# EAGLE design battery (EAGLE 6.4)
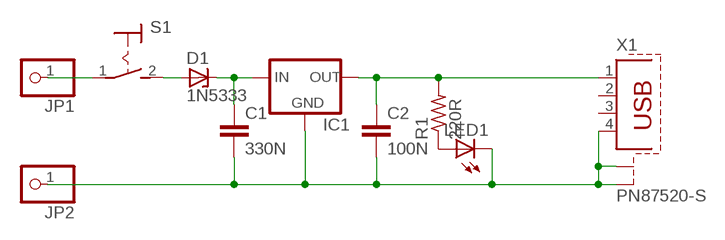
[diagram p0: schematic, sheet 1]

## Parts
C1  330N  C-EU025-025X050  [C025-025X050]
C2  100N  C-EU025-025X050  [C025-025X050]
D1  1N5333  [C1702-15]
IC1  78MXXS  [78MXXS]
JP1  PINHD-1X1  [1X01]
JP2  PINHD-1X1  [1X01]
LED1  LED3MM  [LED3MM]
R1  220R  R-US_0414/15  [0414/15]
S1  MS243  [MS243]
X1  PN87520-S  [PN87520-S]

## Nets
N$1: LED1.A R1.1
N$2: C1.2 C2.2 IC1.GND JP2.1 LED1.K(C) X1.4 X1.S1 X1.S2
N$3: JP1.1 S1.1(P)
N$4: C1.1 D1.C IC1.IN
N$5: C2.1 IC1.OUT R1.2 X1.1
N$6: D1.A S1.2(S)
Unconnected: X1.2 X1.3

## Library data of the parts
C1 C2 = rcl:C-EU: CAPACITOR, European symbol
D1 = diode:1N5333: Z DIODE 3.3 V, 5W, 5 percent (Motorola)
IC1 = v-reg:78MXXS: VOLTAGE REGULATOR
JP1 JP2 = pinhead:PINHD-1X1: PIN HEADER
LED1 = led:LED: LED OSRAM: - CHIPLED LG R971, LG N971, LY N971, LG Q971, LY Q971, LO R971, LY R971 LH N974, LH R974 LS Q976, LO Q976, LY Q976 LO Q996 - Hyper CHIPLED LW Q18S LB Q993, LB Q99A, LB R99A - SideLED LS A670, LO A670, LY A670, LG A670, LP A670 LB A673, LV A673, LT A673, LW A673 LH A674 LY A675 LS A676, LA A676, LO A676, LY A676, LW A676 LS A679, LY A679, LG A679 - Hyper Micro SIDELED® LS Y876, LA Y876, LO Y876, LY Y876 LT Y87S - SmartLED LW L88C, LW L88S LB L89C, LB L89S, LG L890 LS L89K, LO L89K, LY L89K LS L896, LA L896, LO L896, LY L896 - TOPLED LS T670, LO T670, LY T670, LG T670, LP T670 LSG T670, LSP T670, LSY T670, LOP T670, LYG T670 LG T671, LOG T671, LSG T671 LB T673, LV T673, LT T673, LW T673 LH T674 LS T676, LA T676, LO T676, LY T676, LB T676, LH T676, LSB T676, LW T676 LB T67C, LV T67C, LT T67C, LS T67K, LO T67K, LY T67K, LW E67C LS E67B, LA E67B, LO E67B, LY E67B, LB E67C, LV E67C, LT E67C LW T67C LS T679, LY T679, LG T679 LS T770, LO T770, LY T770, LG T770, LP T770 LB T773, LV T773, LT T773, LW T773 LH T774 LS E675, LA E675, LY E675, LS T675 LS T776, LA T776, LO T776, LY T776, LB T776 LHGB T686 LT T68C, LB T68C - Hyper Mini TOPLED® LB M676 - Mini TOPLED Santana® LG M470 LS M47K, LO M47K, LY M47K Source: http://www.osram.convergy.de LUXEON: - LUMILED® LXK2-PW12-R00, LXK2-PW12-S00, LXK2-PW14-U00, LXK2-PW14-V00 LXK2-PM12-R00, LXK2-PM12-S00, LXK2-PM14-U00 LXK2-PE12-Q00, LXK2-PE12-R00, LXK2-PE12-S00, LXK2-PE14-T00, LXK2-PE14-U00 LXK2-PB12-K00, LXK2-PB12-L00, LXK2-PB12-M00, LXK2-PB14-N00, LXK2-PB14-P00, LXK2-PB14-Q00 LXK2-PR12-L00, LXK2-PR12-M00, LXK2-PR14-Q00, LXK2-PR14-R00 LXK2-PD12-Q00, LXK2-PD12-R00, LXK2-PD12-S00 LXK2-PH12-R00, LXK2-PH12-S00 LXK2-PL12-P00, LXK2-PL12-Q00, LXK2-PL12-R00 Source: www.luxeon.com KINGBRIGHT: KA-3528ASYC Source: www.kingbright.com
R1 = rcl:R-US_: RESISTOR, American symbol
S1 = switch:MS243: TOGGLE SWITCH
X1 = con-berg:PN87520-S; OC_FARNELL: unknown; OC_NEWARK: unknown

## Board
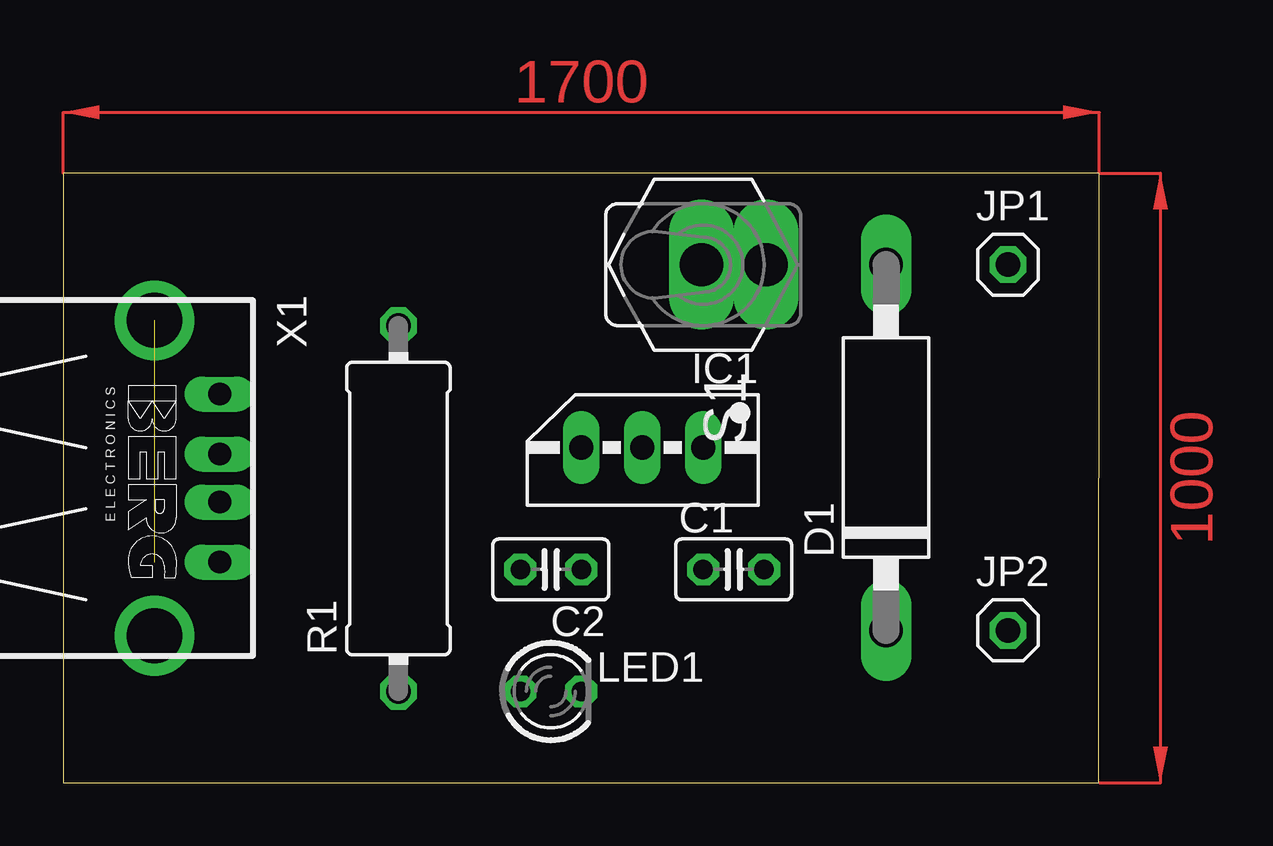
[diagram p1: board, top side]
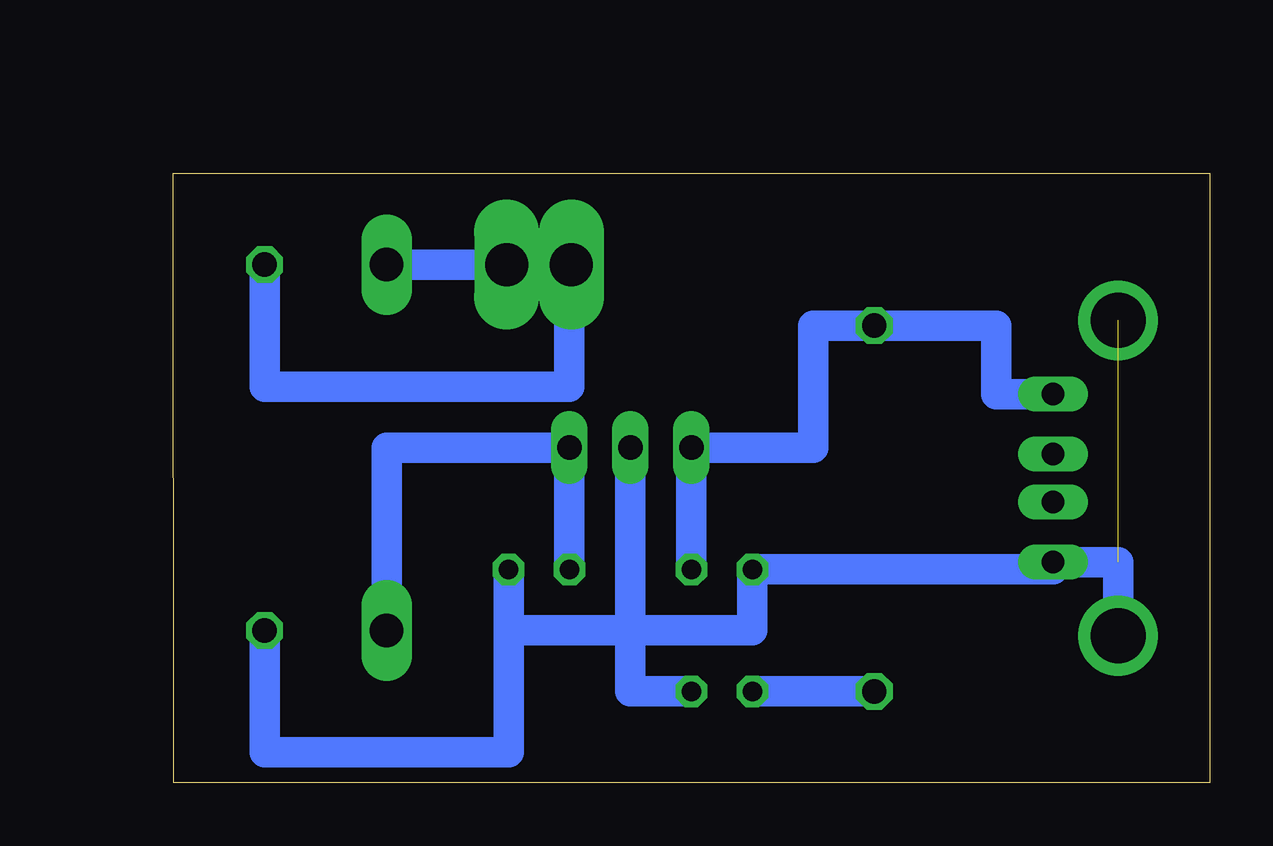
[diagram p2: board, bottom side, seen from below]

Size 43.18 x 25.4 mm. Coordinates in mm from the lower left corner, seen from the top.
Outline: 0,0 43.16,0 43.18,25.4 0,25.4 0,0
Copper layers (1*16): Top 0.035mm / dielectric 1.5mm / Bottom 0.035mm
Design rules "default": minimum track width 10mil, minimum drill 24mil, track to track 8mil, track to pad 8mil, pad to pad 8mil, via to via 8mil, smd to smd 8mil, copper to edge 40mil, drill to drill 8mil, minimum pad ring 10mil, minimum via ring 8mil, stop-mask expansion 4mil, vias tented up to drill 0mil, thermal gap 10mil

### Footprints (pad centres in the part's own frame; a part is rotated, then mirrored left to right if it is on the bottom)
C025-025X050 = drill 0.813 octagon: 1 -1.27,0; 2 1.27,0
C1702-15 = drill 1.397 long: A 7.62,0; C -7.62,0
78MXXS = drill 1.016 long: GND 0,-2.54; IN -2.54,-2.54; OUT 2.54,-2.54
1X01 = drill 1.016 octagon: 1 0,0
LED3MM = drill 0.813 octagon: A -1.27,0; K 1.27,0
0414/15 = drill 1.016 octagon: 1 -7.62,0; 2 7.62,0
MS243 = drill 1.803 pad 2 long: 1 0,-1.346; 2 0,1.346
PN87520-S = drill 0.95 long: 1 -3.5,2.71; 2 -1,2.71; 3 1,2.71; 4 3.5,2.71 | drill 2.3 pad 2.9: S1 -6.57,0; S2 6.57,0

### Placement (x,y rotation side)
C1  27.94,8.89 0 top
C2  20.32,8.89 180 top
D1  34.29,13.97 90 top
IC1  24.13,11.43 180 top
JP1  39.37,21.59 0 top
JP2  39.37,6.35 0 top
LED1  20.32,3.81 0 top
R1  13.97,11.43 90 top
S1  27.94,21.59 270 top
X1  3.81,12.7 270 top

### Tracks (layer width: path | path; a pad name or v marks a point on that pad's centre or on a via)
N$1
  Bottom 1.27: R1.1 LED1.A
N$2  (1 unrouted)
  Bottom 1.27: 29.21,6.35 29.21,1.27 39.37,1.27 JP2.1 | 29.21,6.35 C1.2 | IC1.GND 24.13,6.35 | 24.13,6.35 29.21,6.35 | X1.S2 3.81,9.2 X1.4 6.52,8.89 C2.2 19.05,6.35 24.13,6.35 | LED1.K 24.13,3.81 24.13,6.35
N$3
  Bottom 1.27: JP1.1 39.37,16.51 26.67,16.51 26.67,21.59 S1.1
N$4
  Bottom 1.27: C1.1 IC1.IN 34.29,13.97 D1.C
N$5
  Bottom 1.27: C2.1 IC1.OUT 16.51,13.97 16.51,19.05 R1.2 8.89,19.05 8.89,16.2 X1.1
N$6
  Bottom 1.27: S1.2 D1.A
(copper drawn outside any net)
  shapes: Top area x2